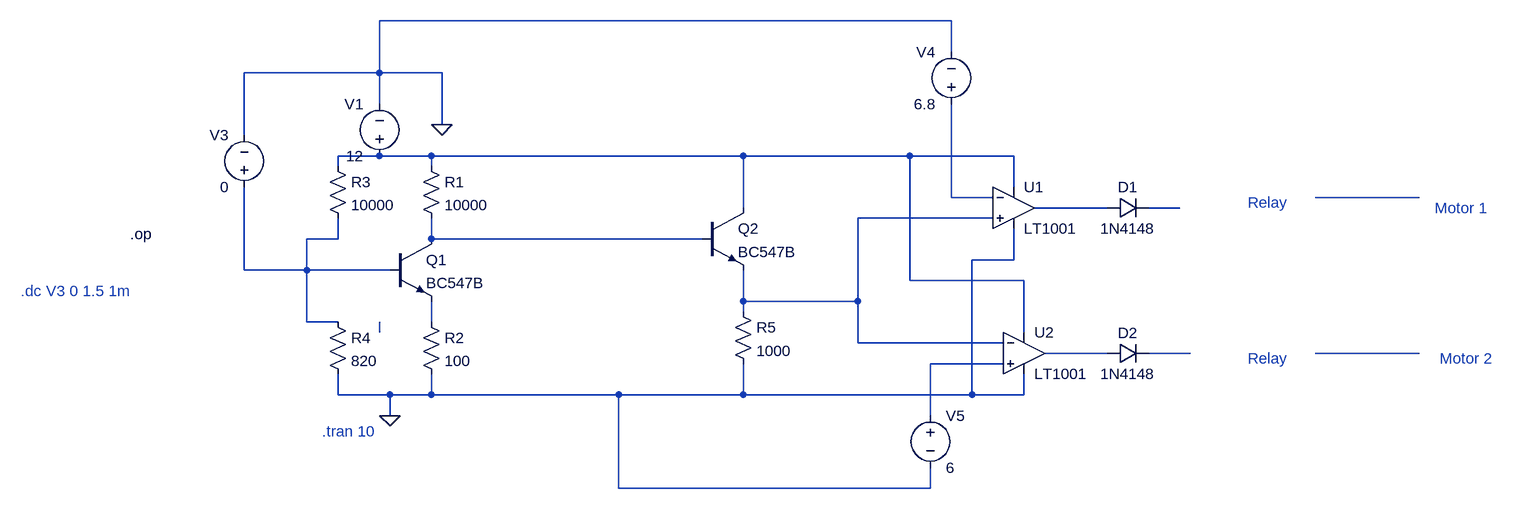
[diagram p0: schematic finalfinaldraft.asc]
finalfinaldraft.asc, the LTspice schematic file:
Version 4
SHEET 1 1852 680
WIRE 1008 -160 128 -160
WIRE 1008 -112 1008 -160
WIRE 128 -80 128 -160
WIRE 128 -80 -80 -80
WIRE 224 -80 128 -80
WIRE 128 -32 128 -80
WIRE 224 0 224 -80
WIRE -80 16 -80 -80
WIRE 128 48 64 48
WIRE 208 48 128 48
WIRE 688 48 208 48
WIRE 944 48 688 48
WIRE 1104 48 944 48
WIRE 64 64 64 48
WIRE 208 64 208 48
WIRE 1104 96 1104 48
WIRE 1008 112 1008 -32
WIRE 1072 112 1008 112
WIRE 1728 112 1568 112
WIRE 688 128 688 48
WIRE 1248 128 1136 128
WIRE 1360 128 1312 128
WIRE 1072 144 864 144
WIRE 64 176 64 144
WIRE 64 176 16 176
WIRE 208 176 208 144
WIRE 624 176 208 176
WIRE 1104 208 1104 160
WIRE 1104 208 1040 208
WIRE -80 224 -80 96
WIRE 16 224 16 176
WIRE 16 224 -80 224
WIRE 144 224 16 224
WIRE 944 240 944 48
WIRE 1120 240 944 240
WIRE 688 272 688 224
WIRE 864 272 864 144
WIRE 864 272 688 272
WIRE 688 288 688 272
WIRE 16 304 16 224
WIRE 64 304 16 304
WIRE 208 304 208 272
WIRE 128 320 128 304
WIRE 1120 320 1120 240
WIRE 864 336 864 272
WIRE 1088 336 864 336
WIRE 1248 352 1152 352
WIRE 1376 352 1312 352
WIRE 1728 352 1568 352
WIRE 1088 368 976 368
WIRE 64 416 64 384
WIRE 144 416 64 416
WIRE 208 416 208 384
WIRE 208 416 144 416
WIRE 496 416 208 416
WIRE 688 416 688 368
WIRE 688 416 496 416
WIRE 1040 416 1040 208
WIRE 1040 416 688 416
WIRE 1120 416 1120 384
WIRE 1120 416 1040 416
WIRE 144 448 144 416
WIRE 976 448 976 368
WIRE 496 560 496 416
WIRE 976 560 976 528
WIRE 976 560 496 560
FLAG 144 448 0
FLAG 224 0 0
SYMBOL npn 144 176 R0
SYMATTR InstName Q1
SYMATTR Value BC547B
SYMBOL res 192 48 R0
SYMATTR InstName R1
SYMATTR Value 10000
SYMBOL res 192 288 R0
SYMATTR InstName R2
SYMATTR Value 100
SYMBOL res 48 48 R0
SYMATTR InstName R3
SYMATTR Value 10000
SYMBOL res 48 288 R0
SYMATTR InstName R4
SYMATTR Value 820
SYMBOL voltage 128 64 R180
WINDOW 0 24 96 Left 2
WINDOW 3 24 16 Left 2
WINDOW 123 0 0 Left 0
WINDOW 39 0 0 Left 0
SYMATTR InstName V1
SYMATTR Value 12
SYMBOL voltage -80 112 R180
WINDOW 0 24 96 Left 2
WINDOW 3 24 16 Left 2
WINDOW 123 0 0 Left 0
WINDOW 39 0 0 Left 0
SYMATTR InstName V3
SYMATTR Value 0
SYMBOL npn 624 128 R0
SYMATTR InstName Q2
SYMATTR Value BC547B
SYMBOL res 672 272 R0
SYMATTR InstName R5
SYMATTR Value 1000
SYMBOL OpAmps\\LT1001 1104 64 R0
SYMATTR InstName U1
SYMBOL OpAmps\\LT1001 1120 288 R0
SYMATTR InstName U2
SYMBOL diode 1248 144 R270
WINDOW 0 32 32 VTop 2
WINDOW 3 0 32 VBottom 2
SYMATTR InstName D1
SYMATTR Value 1N4148
SYMBOL diode 1248 368 R270
WINDOW 0 32 32 VTop 2
WINDOW 3 0 32 VBottom 2
SYMATTR InstName D2
SYMATTR Value 1N4148
SYMBOL voltage 1008 -16 R180
WINDOW 0 24 96 Left 2
WINDOW 3 24 16 Left 2
WINDOW 123 0 0 Left 0
WINDOW 39 0 0 Left 0
SYMATTR InstName V4
SYMATTR Value 6.8
SYMBOL voltage 976 432 R0
WINDOW 123 0 0 Left 0
WINDOW 39 0 0 Left 0
SYMATTR InstName V5
SYMATTR Value 6
TEXT 40 472 Left 2 ;.tran 10
TEXT -424 256 Left 2 ;.dc V3 0 1.5 1m
TEXT 1752 128 Left 2 ;Motor 1
TEXT 1760 360 Left 2 ;Motor 2
TEXT 1464 120 Left 2 ;Relay
TEXT 1464 360 Left 2 ;Relay
TEXT -256 168 Left 2 !.op

The netlist it stands for:
* finalfinaldraft.asc
Q1 N008 N007 N009 0 BC547B
R1 N001 N008 10000
R2 N009 0 100
R3 N001 N007 10000
R4 N007 0 820
V1 N001 0 12
V3 N007 0 0
Q2 N001 N008 N006 0 BC547B
R5 N006 0 1000
XU1 N006 N002 N001 0 N004 LT1001  ; pins In+ In- V+ V- OUT
XU2 N014 N006 N001 0 N011 LT1001  ; pins In+ In- V+ V- OUT
D1 N004 N005 1N4148
D2 N011 N012 1N4148
V4 N002 0 6.8
V5 N014 0 6
.model D D
.lib standard.dio
.model NPN NPN
.model PNP PNP
.lib standard.bjt
* .tran 10
* .dc V3 0 1.5 1m
* Motor 1
* Motor 2
* Relay
* Relay
.op
.lib LTC.lib
.backanno
.end